# EAGLE design AJH_Wasp_1_0 (EAGLE 9.5.2)
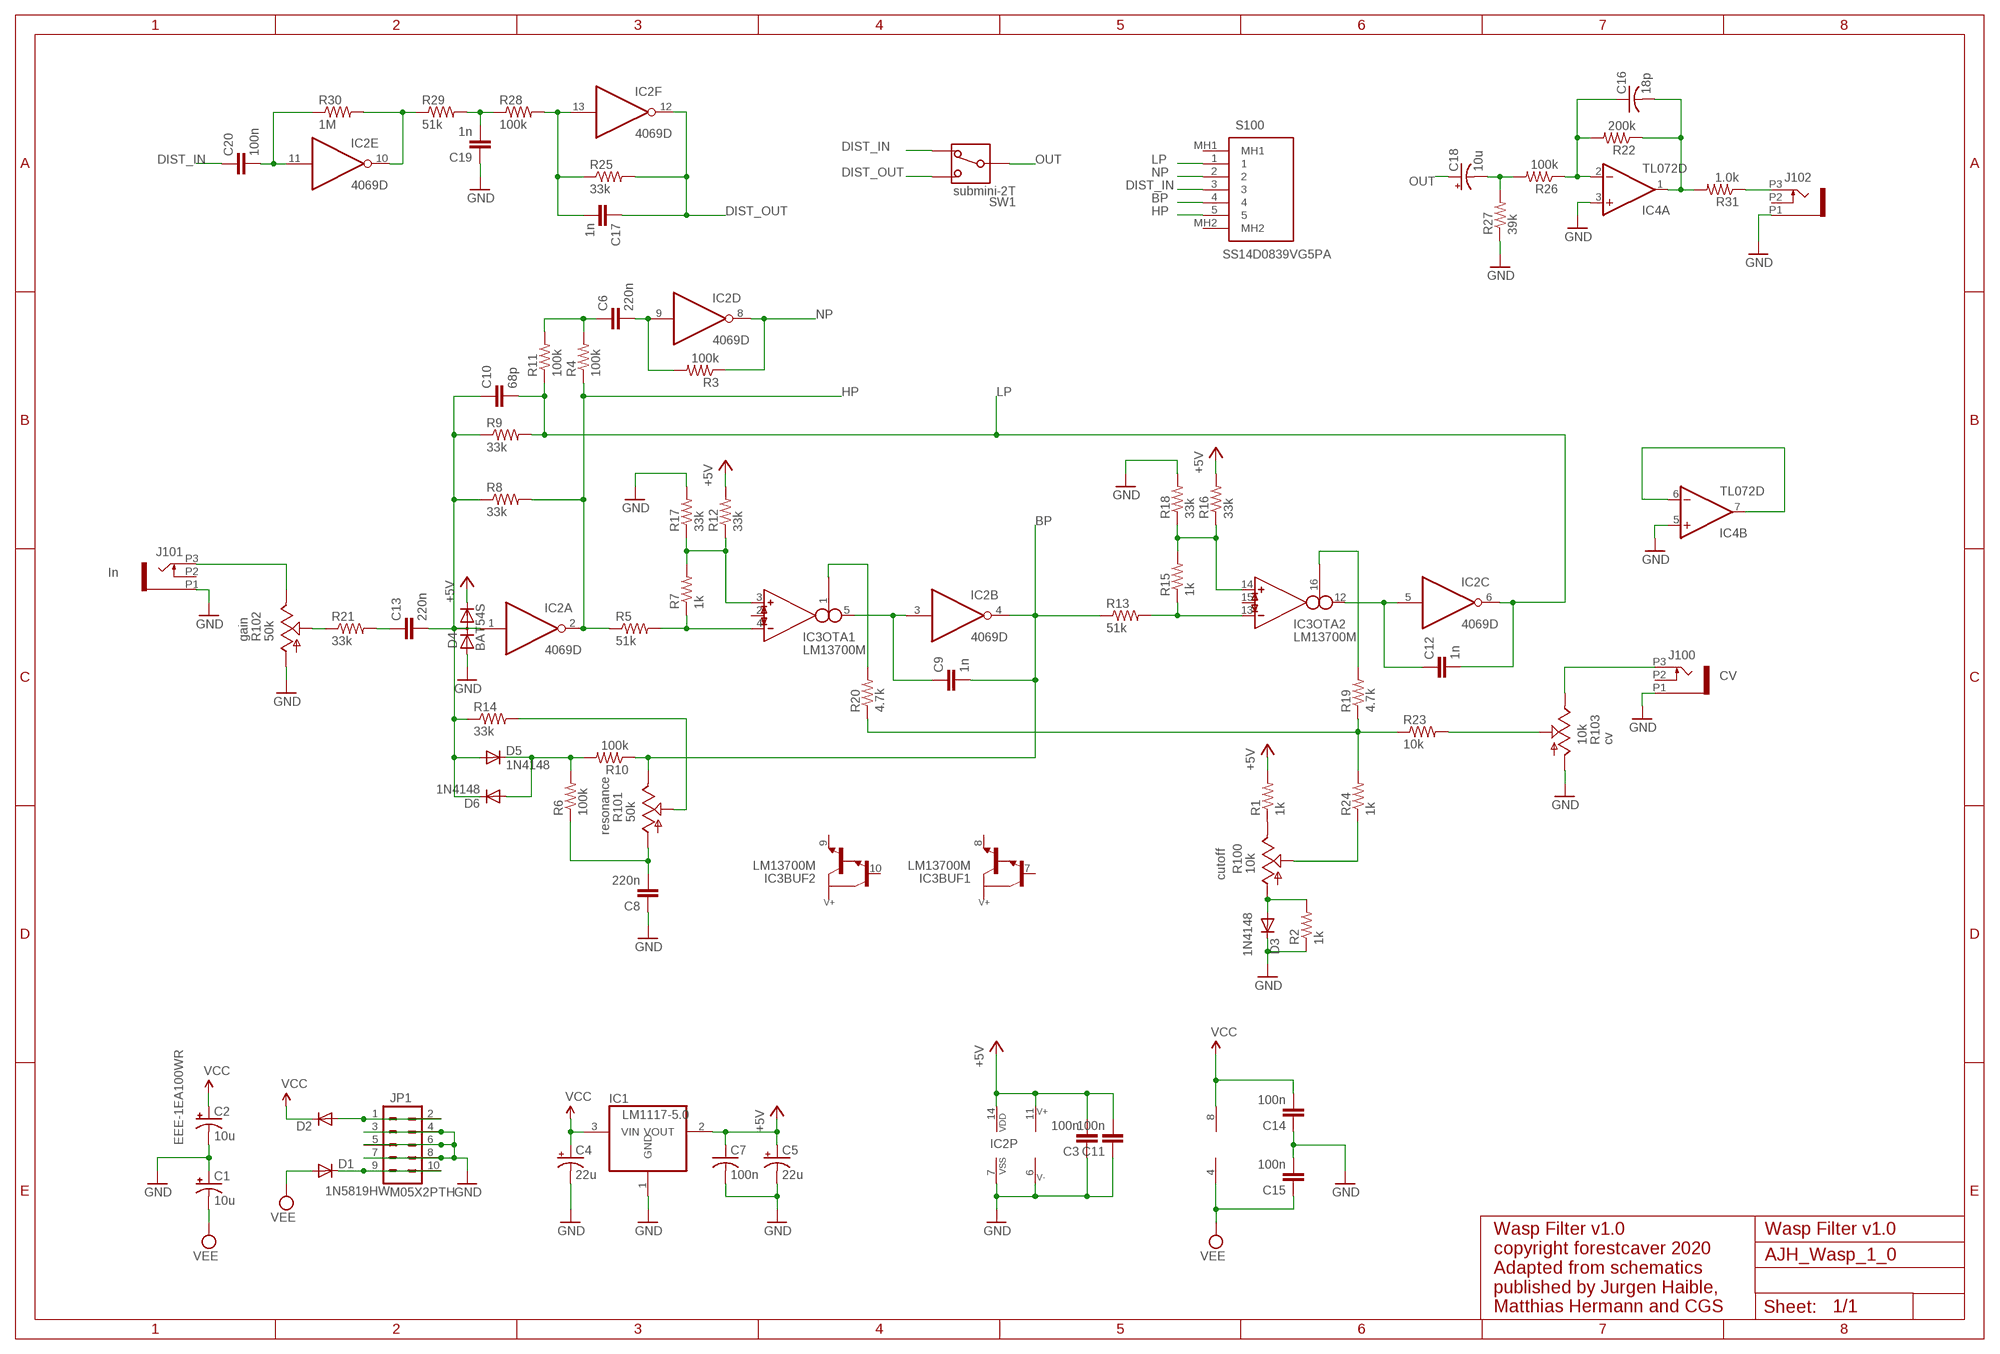
[diagram p0: schematic, sheet 1]

## Parts
C1  10u  CPOL-USB  [PANASONIC_B]
C2  10u  CPOL-USB  [PANASONIC_B]
C3  100n  C-EUC0603  [C0603]
C4  22u  CPOL-USC  [PANASONIC_C]
C5  22u  CPOL-USC  [PANASONIC_C]
C6  220n  C-EUC0603  [C0603]
C7  100n  C-USC0603  [C0603]
C8  220n  C-EUC0603  [C0603]
C9  1n  C-EUC0603  [C0603]
C10  68p  C-EUC0603  [C0603]
C11  100n  C-EUC0603  [C0603]
C12  1n  C-EUC0603  [C0603]
C13  220n  C-EUC0603  [C0603]
C14  100n  C-EUC0603  [C0603]
C15  100n  C-EUC0603  [C0603]
C16  18p  C-USC0603  [C0603]
C17  1n  C-EUC0603  [C0603]
C18  10u  CPOL-USB  [PANASONIC_B]
C19  1n  C-EUC0603  [C0603]
C20  100n  C-EUC0603  [C0603]
D1  1N5819HW  DIODE-SOD123  [SOD123]
D2  1N5819HW  DIODE-SOD123  [SOD123]
D3  1N4148  DIODE-SOD523  [SOD523]
D4  BAT54S  DIODE_2CACA-SOT23  [SOT23]
D5  1N4148  DIODE-SOD523  [SOD523]
D6  1N4148  DIODE-SOD523  [SOD523]
IC1  LM1117-5.0  REG1117  [SOT223]
IC2  4069D  [SO14]
IC3  LM13700M  [SO16]
IC4  TL072D  [SO08]
J100  PJ301_THONKICONN8  [WQP_PJ_301M8]
J101  PJ301_THONKICONN8  [WQP_PJ_301M8]
J102  PJ301_THONKICONN6  [WQP_PJ_301M6]
JP1  M05X2PTH  [AVR_ICSP]
R1  1k  R-US_R0603  [R0603]
R2  1k  R-US_R0603  [R0603]
R3  100k  R-US_R0603  [R0603]
R4  100k  R-US_R0603  [R0603]
R5  51k  R-US_R0603  [R0603]
R6  100k  R-US_R0603  [R0603]
R7  1k  R-US_R0603  [R0603]
R8  33k  R-US_R0603  [R0603]
R9  33k  R-US_R0603  [R0603]
R10  100k  R-US_R0603  [R0603]
R11  100k  R-US_R0603  [R0603]
R12  33k  R-US_R0603  [R0603]
R13  51k  R-US_R0603  [R0603]
R14  33k  R-US_R0603  [R0603]
R15  1k  R-US_R0603  [R0603]
R16  33k  R-US_R0603  [R0603]
R17  33k  R-US_R0603  [R0603]
R18  33k  R-US_R0603  [R0603]
R19  4.7k  R-US_R0603  [R0603]
R20  4.7k  R-US_R0603  [R0603]
R21  33k  R-US_R0603  [R0603]
R22  200k  R-US_R0603  [R0603]
R23  10k  R-US_R0603  [R0603]
R24  1k  R-US_R0603  [R0603]
R25  33k  R-US_R0603  [R0603]
R26  100k  R-US_R0603  [R0603]
R27  39k  R-US_R0603  [R0603]
R28  100k  R-US_R0603  [R0603]
R29  51k  R-US_R0603  [R0603]
R30  1M  R-US_R0603  [R0603]
R31  1.0k  R-US_R0603  [R0603]
R100  10k  POT_USVERTICAL_PS  [ALPS_POT_VERTICAL_PS]
R101  50k  POT_USVERTICAL_PS  [ALPS_POT_VERTICAL_PS]
R102  50k  POT_USVERTICAL_PS  [ALPS_POT_VERTICAL_PS]
R103  10k  POT_USVERTICAL_PS  [ALPS_POT_VERTICAL_PS]
S100  SS14D0839VG5PA  [SS14D0839VG5PA]
SW1  submini-2T  SPDTT  [SPDT-SUB]

## Nets
+5V: C3.2 C5.+ C7.1 C11.2 D4.2(C) IC1.2(VOUT) IC2.14(P:VDD) IC3.11(SUPPLY:V+) R1.2 R12.2 R16.2
BP: C9.2 IC2.4(B:O) R10.1 R13.1 R101.P$1(E) S100.4
DIST_IN: C20.1 S100.3 SW1.P$3
DIST_OUT: C17.1 IC2.12(F:O) R25.2 SW1.P$1
GND: C1.+ C2.- C3.1 C4.- C5.- C7.2 C8.1 C11.1 C14.1 C15.2 C19.1 D3.C D4.1(A) IC1.1(GND) IC2.7(P:VSS) IC3.6(SUPPLY:V-) IC4.3(A:+IN) IC4.5(B:+IN) J100.P1 J101.P1 J102.P1 JP1.3 JP1.4 JP1.5 JP1.6 JP1.7 JP1.8 R2.1 R17.2 R18.2 R27.1 R102.P$3(A) R103.P$3(A)
HP: IC2.2(A:O) R4.1 R5.1 R8.2 S100.5
LP: C10.2 C12.2 IC2.6(C:O) R9.2 R11.1 S100.1
N$1: J101.P3 R102.P$1(E)
N$2: R21.1 R102.P$2(S)
N$3: C13.1 R21.2
N$4: C10.1 C13.2 D4.3(AC) D5.A D6.C IC2.1(A:I) R8.1 R9.1 R14.1
N$5: IC3.14(OTA2:IN_P) R15.2 R16.1 R18.1
N$6: D2.A JP1.1 JP1.2
N$7: IC3.1(OTA1:I_BIAS) R20.2
N$8: C6.2 IC2.9(D:I) R3.2
N$9: C6.1 R4.2 R11.2
N$10: D5.C D6.A R6.2 R10.2
N$11: IC3.13(OTA2:IN_N) R13.2 R15.1
N$12: C8.2 R6.1 R101.P$3(A)
N$13: R14.2 R101.P$2(S)
N$14: IC3.3(OTA1:IN_P) R7.2 R12.1 R17.1
N$15: IC3.4(OTA1:IN_N) R5.2 R7.1
N$16: C9.1 IC2.3(B:I) IC3.5(OTA1:OUT)
N$17: IC3.16(OTA2:I_BIAS) R19.2
N$18: R19.1 R20.1 R23.1 R24.2
N$19: C12.1 IC2.5(C:I) IC3.12(OTA2:OUT)
N$20: D1.C JP1.9 JP1.10
N$21: R23.2 R103.P$2(S)
N$22: R1.1 R100.P$1(E)
N$23: D3.A R2.2 R100.P$3(A)
N$24: R24.1 R100.P$2(S)
N$25: C20.2 IC2.11(E:I) R30.1
N$26: IC2.10(E:O) R29.1 R30.2
N$27: C19.2 R28.1 R29.2
N$28: C17.2 IC2.13(F:I) R25.1 R28.2
N$29: J100.P3 R103.P$1(E)
N$30: IC4.6(B:-IN) IC4.7(B:OUT)
N$35: C18.- R26.2 R27.2
N$36: C16.1 IC4.2(A:-IN) R22.2 R26.1
N$37: C16.2 IC4.1(A:OUT) R22.1 R31.2
NP: IC2.8(D:O) R3.1 S100.2
OUT: C18.+ SW1.P$2
ROUT_JACK1: J102.P3 R31.1
VCC: C2.+ C4.+ C14.2 D2.C IC1.3(VIN) IC4.8(P:V+)
VEE: C1.- C15.1 D1.A IC4.4(P:V-)
Unconnected: IC3.2(OTA1:I_DIODE) IC3.7(BUF1:B) IC3.8(BUF1:E) IC3.9(BUF2:E) IC3.10(BUF2:B) IC3.15(OTA2:I_DIODE) J100.P2 J101.P2 J102.P2 S100.MH1 S100.MH2

## Notes on the sheet
- EEE-1EA100WR
- Wasp Filter v1.0
  copyright forestcaver 2020
  Adapted from schematics
  published by Jurgen Haible,
  Matthias Hermann and CGS
- Wasp Filter v1.0

## Library data of the parts
C1 C2 C4 C5 C18 = rcl:CPOL-US: POLARIZED CAPACITOR, American symbol
C3 C6 C8-C15 C17 C19 C20 = rcl:C-EU: CAPACITOR, European symbol; SPICEPREFIX: C
C7 C16 = rcl:C-US: CAPACITOR, American symbol
D1-D3 D5 D6 = diode:DIODE-: DIODE
D4 = diode:DIODE_2CACA-: 2 Diodes - Cathode-Anode|Cathode-Anode
IC1 = og-vreg:REG1117: 800mA and 1A Low Dropout (LDO) Positive Regulator 1.8V, 2.5V, 2.85V, 3.3V, 5V, and Adj
IC2 = 40xx:4069: Hex INVERTER
IC3 = ota:LM13700: Dual OTA with buffers
IC4 = linear:TL072: OP AMP
J100 = og-pj301:PJ301_THONKICONN; LABEL: CV
J101 = og-pj301:PJ301_THONKICONN; LABEL: In
J102 = og-pj301:PJ301_THONKICONN
JP1 = og-header:M05X2: Header 5x2 Standard 10-pin dual row 0.1" header. Commonly used with AVR-ISP. Use with Spark Fun Electronics SKU: PRT-00778
R1-R21 R23-R25 R28-R30 = rcl:R-US_: RESISTOR, American symbol; SPICEPREFIX: R
R22 R26 R27 R31 = rcl:R-US_: RESISTOR, American symbol
R100 = og-pots:POT_US; LABEL: cutoff
R101 = og-pots:POT_US; LABEL: resonance
R102 = og-pots:POT_US; LABEL: gain
R103 = og-pots:POT_US; LABEL: cv
S100 = SS14D0839VG5PA:SS14D0839VG5PA: Slide Switches Source: Datasheet <https://componentsearchengine.com/Datasheets/1/SS14D0839VG5PA.pdf>; DESCRIPTION: Slide Switches; HEIGHT: 6.7mm; MANUFACTURER_NAME: C & K COMPONENTS; MANUFACTURER_PART_NUMBER: SS14D0839VG5PA; MOUSER_PART_NUMBER: 611-SS-14D0839-VG5PA; MOUSER_PRICE-STOCK: https://www.mouser.com/Search/Refine.aspx?Keyword=611-SS-14D0839-VG5PA
SW1 = malekko main:SPDT: SPDT Switch

## Board
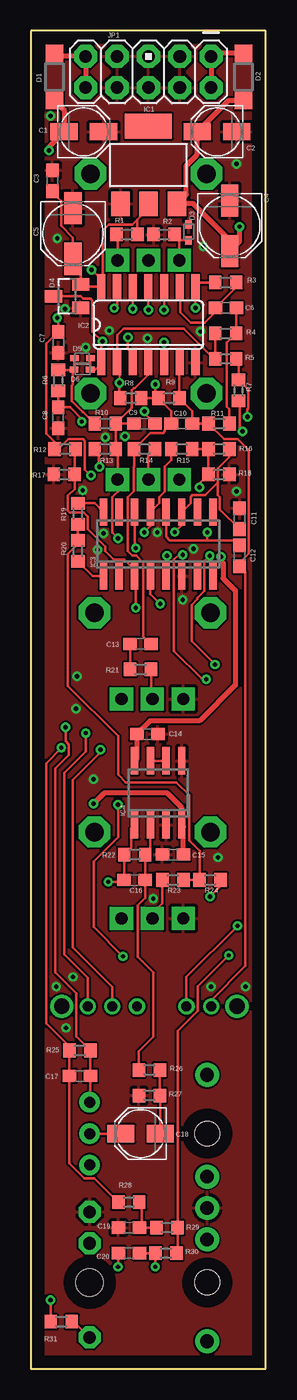
[diagram p1: board, top side]
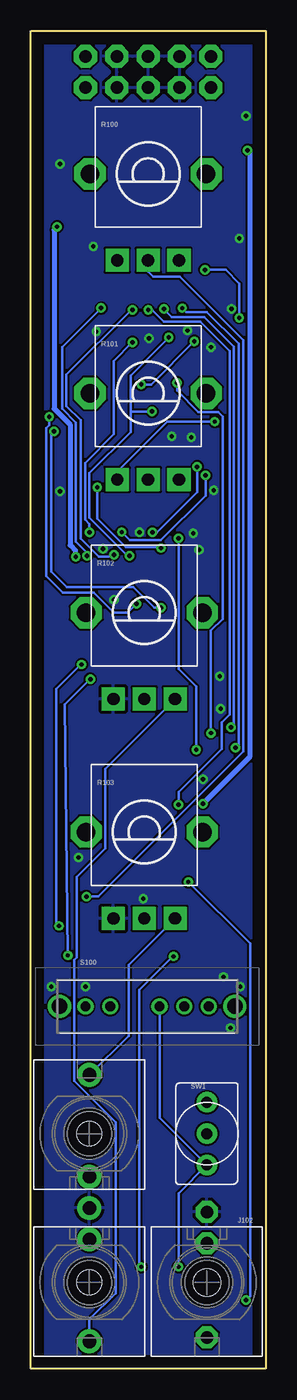
[diagram p2: board, bottom side, seen from below]

Size 19.03 x 108.43 mm. Coordinates in mm from the lower left corner, seen from the top.
Outline: 0,0 19.03,0 19.03,108.43 0,108.43 0,0
Copper layers (1*16): Top 0.035mm / dielectric 1.5mm / Bottom 0.035mm
Design rules "default": minimum track width 6mil, minimum drill 0.35mm, track to track 6mil, track to pad 6mil, pad to pad 6mil, via to via 6mil, smd to smd 6mil, copper to edge 40mil, drill to drill 6mil, minimum pad ring 10mil, minimum via ring 8mil, stop-mask expansion 4mil, vias tented up to drill 0mil, thermal gap 10mil

### Footprints (pad centres in the part's own frame; a part is rotated, then mirrored left to right if it is on the bottom)
PANASONIC_B = smd 2.2 x 1.4: + 1.6,0; - -1.6,0
C0603 = smd 1.1 x 1: 1 -0.85,0; 2 0.85,0
PANASONIC_C = smd 2.6 x 1.4: + 2.05,0; - -2.05,0
SOD123 = smd 1.4 x 1.4: A 1.9,0; C -1.9,0
SOD523 = smd 0.7 x 0.5: A 0.7,0; C -0.6,0
SOT23 = smd 1 x 1.4: 1 -0.95,-1.1; 2 0.95,-1.1; 3 0,1.1
SOT223 = smd 1.499 x 2.007: 1 -2.261,-3.15; 2 0.025,-3.15; 3 2.311,-3.15 | smd 3.81 x 2.007: 4 0,3.15
SO14 = smd 0.66 x 2.032: 1 -3.81,-3.073; 2 -2.54,-3.073; 3 -1.27,-3.073; 4 0,-3.073; 5 1.27,-3.073; 6 2.54,-3.073; 7 3.81,-3.073; 8 3.81,3.073; 9 2.54,3.073; 10 1.27,3.073; 11 0,3.073; 12 -1.27,3.073; 13 -2.54,3.073; 14 -3.81,3.073
SO16 = smd 0.6 x 2.2: 1 -4.445,-2.6; 2 -3.175,-2.6; 3 -1.905,-2.6; 4 -0.635,-2.6; 5 0.635,-2.6; 6 1.905,-2.6; 7 3.175,-2.6; 8 4.445,-2.6; 9 4.445,2.6; 10 3.175,2.6; 11 1.905,2.6; 12 0.635,2.6; 13 -0.635,2.6; 14 -1.905,2.6; 15 -3.175,2.6; 16 -4.445,2.6
SO08 = smd 0.6 x 2.2: 1 -1.905,-2.6; 2 -0.635,-2.6; 3 0.635,-2.6; 4 1.905,-2.6; 5 1.905,2.6; 6 0.635,2.6; 7 -0.635,2.6; 8 -1.905,2.6
WQP_PJ_301M8 = drill 1.1 pad 1.93: P1 0,-6.032; P2 0,-3.493; P3 0,4.763 | hole 2: 0,0
WQP_PJ_301M6 = drill 1.016 pad 1.778 octagon: P1 0,-5.715; P2 0,-3.175; P3 0,4.445 | hole 2.2: 0,0
AVR_ICSP = drill 1.016 pad 1.88 octagon: 1 -1.27,5.08; 2 1.27,5.08; 3 -1.27,2.54; 4 1.27,2.54; 5 -1.27,0; 6 1.27,0; 7 -1.27,-2.54; 8 1.27,-2.54; 9 -1.27,-5.08; 10 1.27,-5.08
R0603 = smd 1 x 1.1: 1 -0.85,0; 2 0.85,0
ALPS_POT_VERTICAL_PS = drill 1 pad 1.88 square: P$1 -2.5,7; P$2 0,7; P$3 2.5,7 | drill 1.5 pad 2.54 octagon: P$4 -4.7,0; P$5 4.7,0
SS14D0839VG5PA = drill 0.8 pad 1.3: 1 0,0; 2 2,0; 3 6,0; 4 8,0; 5 10,0 | drill 1.25 pad 1.875: MH1 -2.1,0; MH2 12.1,0
SPDT-SUB = drill 0.889 pad 1.651: P$1 0,2.54; P$2 0,0; P$3 0,-2.54

### Placement (x,y rotation side)
C1  4.29,100.25 0 top
C2  15.08,100.25 180 top
C3  1.75,96.28 270 top
C4  16.11,92.63 270 top
C5  3.41,92 270 top
C6  15.8,85.96 180 top
C7  2.22,83.19 270 top
C8  2.22,77.07 90 top
C9  9.21,76.6 180 top
C10  12.22,76.6 0 top
C11  16.91,68.9 270 top
C12  16.91,65.88 270 top
C13  8.89,58.74 0 top
C14  9.45,51.44 180 top
C15  11.51,41.67 180 top
C16  8.41,39.61 180 top
C17  3.97,23.73 180 top
C18  8.89,19.05 180 top
C19  7.94,11.43 0 top
C20  7.94,9.37 0 top
D1  1.91,104.7 270 top
D2  17.22,104.7 90 top
D3  12.78,92.15 270 top
D4  2.94,86.92 90 top
D5  4.13,81.92 0 top
D6  4.21,80.96 180 top
IC1  9.53,97.55 0 top
IC2  9.53,84.61 0 top
IC3  10.32,66.83 0 top
IC4  10.32,46.67 0 top
J100  14.29,19.05 0 bottom
J101  14.29,6.99 180 bottom
J102  4.76,6.99 180 bottom
JP1  9.53,105.09 270 top
R1  7.78,91.92 0 top
R2  10.79,91.92 0 top
R3  15.8,88.03 0 top
R4  15.8,83.9 0 top
R5  15.8,81.84 0 top
R6  2.22,80.09 90 top
R7  16.83,79.3 270 top
R8  8.1,78.66 180 top
R9  11.19,78.66 0 top
R10  6.03,76.6 180 top
R11  15.24,76.6 0 top
R12  2.78,74.53 180 top
R13  6.03,74.53 180 top
R14  9.21,74.53 0 top
R15  12.22,74.53 0 top
R16  15.24,74.53 0 top
R17  2.7,72.47 180 top
R18  15.24,72.47 0 top
R19  3.81,69.29 90 top
R20  3.81,66.28 270 top
R21  8.89,56.67 180 top
R22  8.41,41.67 0 top
R23  11.51,39.61 180 top
R24  14.53,39.61 180 top
R25  3.97,25.8 0 top
R26  9.6,24.21 0 top
R27  9.6,22.15 0 top
R28  7.94,13.49 180 top
R29  11.03,11.43 180 top
R30  10.95,9.37 0 top
R31  2.46,3.81 180 top
R100  9.53,96.84 180 bottom
R101  9.53,79.06 180 bottom
R102  9.84,61.28 180 bottom
R103  9.84,43.5 180 bottom
S100  14.61,29.37 0 bottom
SW1  4.76,19.05 0 bottom

### Tracks (layer width: path | path; a pad name or v marks a point on that pad's centre or on a via)
+5V  (via drill 0.35)
  Top 0.203: IC1.2 9.55,94.06 8.63,93.14 | R1.2 8.63,93.14 | C3.2 1.75,95.35 2.46,94.64 2.46,92.64 3.41,91.69 C5.+ 4.04,89.32 D4.2 4.21,87.69 IC2.14 5.83,87.8 5.83,88.15 | 5.83,88.15 5.83,92.23 6.32,92.72 8.21,92.72 8.63,93.14 | R16.2 16.09,73.88 15.14,72.93 15.14,71.81 | 15.14,71.81 14.12,70.79 13.09,70.79 12.94,70.64 12.94,70.15 IC3.11 12.37,69.28 12.22,69.13 12.22,68.36 v11.66,67.8 | v2.14,85.17 2.22,85.09 C7.1 1.26,83.07 1.26,75.78 1.93,75.11 R12.2 2.22,74.53 3.02,75.34 4.23,75.34 4.38,75.19 4.38,72.88 v4.87,72.39 | v4.92,89.06 5.83,88.15 | C11.2 15.32,69.64 15.32,70.64 15.14,70.81 15.14,71.81
  Bottom 0.203: v4.92,89.06 3.25,89.06 2.14,87.95 v2.14,85.17 | v4.87,72.39 4.87,70.78 8.49,67.15 11.01,67.15 v11.66,67.8
BP  (via drill 0.35)
  Top 0.203: R10.1 C9.2 | R10.1 R13.1 7.03,74.39 R101.P$1 7.03,71.07 6.59,70.64 6.59,67.78 v7.06,67.31 | R10.1 8.19,77.91 8.19,79.32 8.34,79.47 8.42,79.47 9.53,80.57 IC2.4 | v5.64,50.16 5.64,49.93 3.41,47.7 3.41,34.15 6.61,30.96 S100.4
  Bottom 0.203: v7.06,67.31 7.06,56.71 5.64,55.29 v5.64,50.16
DIST_IN  (via drill 0.35)
  Top 0.203: v7.06,8.26 7.06,9.34 C20.1
  Bottom 0.203: S100.3 8.57,29.34 8.57,20.32 SW1.P$3 7.06,14.21 v7.06,8.26
DIST_OUT  (via drill 0.35)
  Top 0.203: 4.53,25.8 R25.2 | SW1.P$1 4.82,21.65 C17.1 R25.2 | IC2.12 v8.26,85.88 | v2.81,51.99 2.81,50.86 3.09,50.59 3.09,49.73 1.99,48.63 1.99,32.13 3.7,30.42 3.7,26.92 R25.2
  Bottom 0.203: v8.26,85.88 7.62,85.25 4.98,85.25 2.58,82.84 2.58,52.23 v2.81,51.99
GND  (via drill 0.35)
  other vias: 2.14,91.6 2.78,85.88 16.67,71.12 9.45,83.5 5.4,66.36 13.97,90.96 16.67,97.63 3.73,56.12 3.65,53.5 2.86,27.62 15.16,41.43 12.3,62.31 6.03,75.49 10.24,67.79 4.45,82.79 6.35,84.14 3.41,31.75 17.38,30.96 9.92,38.1 5.87,67.71 4.21,71.2 7.62,75.56 13.73,84.06 1.59,101.52 13.18,66.44 14.61,30.96 2.06,30.96 5.08,47.78
  pour Top: -1.35,109.06 19.68,109.06 19.84,108.9 19.84,-0.56 20,-0.71 -1.43,-0.71 -1.51,-0.64 -1.51,108.9
  pour Bottom: -1.67,109.7 20.32,109.7 20.56,109.46 20.56,-1.11 -2.22,-1.11 -2.3,-1.03 -2.3,109.14 -1.75,109.7
HP  (via drill 0.35)
  Top 0.152: IC2.2 7.18,81.35 v7.18,79.9
  Top 0.203: R4.1 R5.1 14.87,81.84 12.41,84.3 7.52,84.3 6.99,83.76 IC2.2 | 6.99,78.92 R8.2 7.18,78.73 v7.18,79.9 | v4.45,51.51 4.45,50.03 2.7,48.28 2.7,33.57 4.61,31.67 S100.5
  Bottom 0.203: v4.45,51.51 4.45,59.82 3.5,60.77 3.5,77.18 3.85,77.53 5.46,77.53 7.18,79.25 v7.18,79.9
LP
  Top 0.203: IC2.6 12.04,81.52 R9.2 13.07,77.63 C10.2 R11.1 15.65,75.34 16.77,75.34 17.66,74.45 17.66,66.08 16.91,65.32 C12.2 17.38,64.56 17.38,32.62 14.61,29.84 S100.1
N$1
  Bottom 0.203: J101.P3 14.29,3.99 12.17,6.11 12.17,19.97 15.51,23.31 15.51,29.86 | R102.P$1 13.02,48.6 13.02,42.15 15.32,39.85 15.32,33.31 15.51,33.12 15.51,29.86 | 15.51,29.86 15.53,29.88
N$2
  Top 0.203: R102.P$2 9.74,54.38 R21.1
N$3
  Top 0.203: C13.1 R21.2
N$4  (via drill 0.35)
  Top 0.203: D5.A 4.81,81.89 D6.C 5.22,80.96 5.71,81.46 IC2.1 5.71,83.19 v5.79,83.26 4.99,84.07 4.99,86.57 4.84,86.72 4.24,86.72 4.05,86.92 D4.3 | 8.65,78.66 R8.1 R9.1 | R9.1 11.37,77.63 C10.1 10.86,76.08 10.86,75.99 10.71,75.84 9.67,75.84 R14.1 8.36,73.13 8.33,73.1 8.33,71.11 7.86,70.64 7.86,66.26 8.23,65.88 8.52,65.88 9.12,65.28 9.12,59.35 C13.2 | R9.1 10.08,78.92 v10.08,79.77
  Bottom 0.203: v5.79,83.26 9.29,79.77 v10.08,79.77
N$5  (via drill 0.35)
  Top 0.203: R15.2 R16.1 R18.1 13.65,71.73 v13.65,71.44 | v8.49,66.52 8.41,66.6 IC3.14
  Bottom 0.203: v8.49,66.52 8.57,66.6 11.35,66.6 13.65,68.9 v13.65,71.44
N$6
  Top 0.406: D2.A 14.84,106.6 JP1.1 JP1.2
N$7
  Top 0.203: R20.2 5,64.23 IC3.1
N$8
  Top 0.203: IC2.9 12.12,87.64 12.12,85.61 12.96,84.77 14.07,84.77 14.95,85.65 C6.2 16.65,87.66 R3.2
N$9
  Top 0.203: 16.86,85.96 C6.1 R4.2 15.89,83.14 15.89,77.97 16.09,77.77 R11.2
N$10
  Top 0.203: 3.51,81.89 D5.C 3.53,80.98 D6.A 3.38,80.84 | R6.2 3.17,80.94 3.38,81.15 3.38,80.84 | R10.2 4.25,77.53 4.19,77.53 3.3,78.43 3.3,79.69 3.38,79.77 3.38,80.84
N$11  (via drill 0.35)
  Top 0.203: 9.81,69.56 10.4,70.15 10.4,70.64 10.83,71.07 10.83,73.1 11.37,73.64 R15.1 | 9.81,69.56 IC3.13 9.68,68.28 v9.18,67.78 | 9.81,69.79 9.81,69.56 | v5.56,73.1 5.5,73.16 5.5,74.22 R13.2
  Bottom 0.203: v5.56,73.1 5.56,71.05 8.82,67.78 v9.18,67.78
N$12  (via drill 0.35)
  Top 0.203: R6.1 C8.2 3.17,77.92 4.13,76.97 v4.13,76.76
  Bottom 0.203: R101.P$3 12.03,72.69 7.96,76.76 v4.13,76.76
N$13
  Top 0.203: R101.P$2 9.53,74 R14.2
N$14  (via drill 0.35)
  Top 0.203: R12.1 3.55,74.45 R17.1 3.55,71.29 3.01,70.75 3.01,69.54 3.15,69.39 4.27,69.39 4.61,69.05 4.61,68.03 6.03,66.62 6.03,66.28 6.72,65.59 7.55,65.59 8.41,64.72 IC3.3 8.49,64.15 v8.49,61.67 | R7.2 16.91,78.37 16.91,76.2 v17.14,75.96
  Bottom 0.203: v17.14,75.96 17.38,75.72 17.38,64.59 16.14,63.34 10.72,63.34 9.05,61.67 v8.49,61.67
N$15  (via drill 0.35)
  Top 0.203: v17.54,77.15 17.54,77.75 17.63,77.84 17.63,79.34 R7.1 16.83,81.65 R5.2 | IC3.4 9.68,62.79 v10.48,61.99
  Bottom 0.203: v17.54,77.15 17.54,76.46 17.78,76.22 17.78,64.24 16.44,62.91 13.94,62.91 12.3,61.28 11.19,61.28 v10.48,61.99
N$16  (via drill 0.35)
  Top 0.203: IC3.5 10.95,65.11 11.03,65.19 v11.03,65.88 | v7.86,83.58 7.86,82.63 8.26,82.23 IC2.3 | C9.1 9.21,77.45 v9.21,77.58
  Bottom 0.203: v7.86,83.58 10.95,80.49 10.95,77.63 | v11.03,65.88 11.19,65.88 14.29,68.97 14.29,72.59 10.95,75.92 10.95,77.63 | v9.21,77.58 10.9,77.58 10.95,77.63
N$17
  Top 0.203: R19.2 5.16,70.14 IC3.16
N$18
  Top 0.203: R23.1 R24.2 13.68,41.97 12.82,42.83 12.82,46.49 11.78,47.53 7.69,47.53 7.07,48.15 7.07,51.27 3.01,55.34 3.01,66.03 3.81,66.84 R20.1 R19.1
N$19  (via drill 0.35)
  Top 0.203: IC3.12 10.95,67.44 11.26,67.13 14.29,67.13 | C12.1 16.51,67.13 14.29,67.13 | IC2.5 v10.79,83.19 | v14.29,67.79 14.29,67.13
  Bottom 0.203: v10.79,83.19 12.3,81.68 12.3,75.73 14.64,73.39 14.64,68.83 14.29,68.47 v14.29,67.79
N$20
  Top 0.406: D1.C 2.14,106.36 JP1.9 JP1.10
N$21
  Top 0.203: R103.P$2 9.84,36.91 10.66,37.73 R23.2
N$22
  Top 0.203: R1.1 7.03,91.82 R100.P$1
N$23
  Top 0.203: R100.P$3 12.03,91.54 R2.2 12.11,91.45 D3.A
N$24  (via drill 0.35)
  Top 0.203: 15.24,39.74 R24.1 15.38,39.11 v14.53,38.26
  Bottom 0.203: v14.53,38.26 13.57,38.26 1.83,50.01 1.83,83.34 6.99,88.5 9.13,88.5 9.53,88.9 R100.P$2
N$25  (via drill 0.35)
  Top 0.203: C20.2 10.08,9.37 | 10.08,9.37 R30.1 | IC2.11 v9.53,85.8 | v7.46,33.42 5.08,35.8 5.08,41.12 7.06,43.1 v7.06,45.72 | v10.08,8.26 10.08,9.37
  Bottom 0.203: v9.53,85.8 9.21,85.8 8.25,84.85 5.29,84.85 2.93,82.49 2.93,53.02 3.57,52.38 3.57,50.24 7.06,46.75 v7.06,45.72 | v7.46,33.42 7.54,33.42 10.24,30.72 10.24,8.41 v10.08,8.26
N$26  (via drill 0.35)
  Top 0.203: R30.2 11.88,9.45 R29.1 11.88,27.36 13.51,28.99 13.51,30.98 v16.03,33.5 | IC2.10 v10.79,85.8 | v12.3,65.96 11.99,65.96 11.59,65.56 11.59,58.18 13.89,55.88 v14.21,55.88
  Bottom 0.203: v10.79,85.8 10.9,85.8 16.15,80.56 16.15,78.03 15,76.88 15,67.29 13.52,65.8 12.46,65.8 v12.3,65.96 | v14.21,55.88 16.27,53.82 v16.03,33.5
N$27
  Top 0.203: C19.2 8.97,11.43 | 8.97,11.43 R29.2 | R28.1 8.97,13.31 8.97,11.43
N$28  (via drill 0.35)
  Top 0.203: R25.1 3.12,25.72 | IC2.13 6.99,85.95 v6.76,85.95 | v2.46,50.32 2.46,50.29 1.23,49.06 1.23,28 3.12,26.11 R25.1 | R28.2 5.15,15.43 4.32,15.43 3.12,16.63 C17.2 R25.1
  Bottom 0.203: v6.76,85.95 6.45,85.65 4.76,85.65 2.18,83.06 2.18,50.6 v2.46,50.32
N$29
  Bottom 0.203: R103.P$1 11.11,32.73 11.11,26.99 J100.P3
N$30
  Top 0.203: IC4.6 IC4.7
N$35
  Top 0.203: R26.2 R27.2 10.49,22.11 C18.-
N$36
  Top 0.203: R22.2 C16.1 | IC4.2 9.68,42.09 R22.2 | R22.2 9.26,38.16 8.65,37.54 8.65,33.39 9.91,32.13 9.91,26.87 8.75,25.72 R26.1
N$37  (via drill 0.35)
  Top 0.203: IC4.1 8.12,43.78 8.12,42.23 R22.1 C16.2 7.41,39.45 v6.27,39.45 | v1.59,5.56 1.61,5.53 R31.2
  Bottom 0.203: v6.27,39.45 1.27,34.45 1.27,5.87 v1.59,5.56
NP  (via drill 0.35)
  Top 0.203: R3.1 13.68,88.03 IC2.8 v13.34,85.96 | v14.49,65.88 14.05,65.44 14.05,63.03 13.49,62.48 13.49,62.38 13.02,61.91 13.02,58.98 v14.92,57.07 | v16.75,35.88 12.61,31.74 S100.2
  Bottom 0.203: v14.49,65.88 14.49,66.14 15.4,67.05 15.4,76.69 16.5,77.8 16.5,82.8 v13.34,85.96 | v14.92,57.07 15,57.07 16.99,55.09 16.99,36.12 v16.75,35.88
OUT
  Top 0.203: C18.+ SW1.P$2
ROUT_JACK1
  Top 0.203: J102.P3 3.49,3.81 R31.1
VCC  (via drill 0.35)
  Top 0.406: IC4.8 8.6,49.45 C14.2 9.67,52.51 13.67,52.51 16.57,55.4 16.57,63.06 15.58,64.05 15.58,65.32 15.4,65.5 v15.4,65.8 | D2.C 16.03,102.8 C2.+ 13.48,98.39 12.6,97.51 12.6,95.17 IC1.3 13.16,94.4 16.11,91.45 C4.+ 16.91,91.37 v16.91,92.55
  Bottom 0.406: v16.91,92.55 17.14,92.31 17.14,77.79 15.86,76.5 15.86,66.73 15.4,66.28 v15.4,65.8
VEE  (via drill 0.35)
  Top 0.406: D1.A 2.69,102.01 C1.- 1.47,99.03 v1.47,98.74 | C15.1 12.36,43.94 IC4.4 12.22,45.48 11.03,46.67 5.95,46.67 v5.08,45.8
  Bottom 0.406: v1.47,98.74 1.31,98.58 1.31,49.57 v5.08,45.8

### Text on the board
tDocu: Wasp v1.0, copyright forestcaver, 2020